# Altium schematic sheet Sheet1.SchDoc
size A4; SheetNumber: 1; SheetTotal: 1
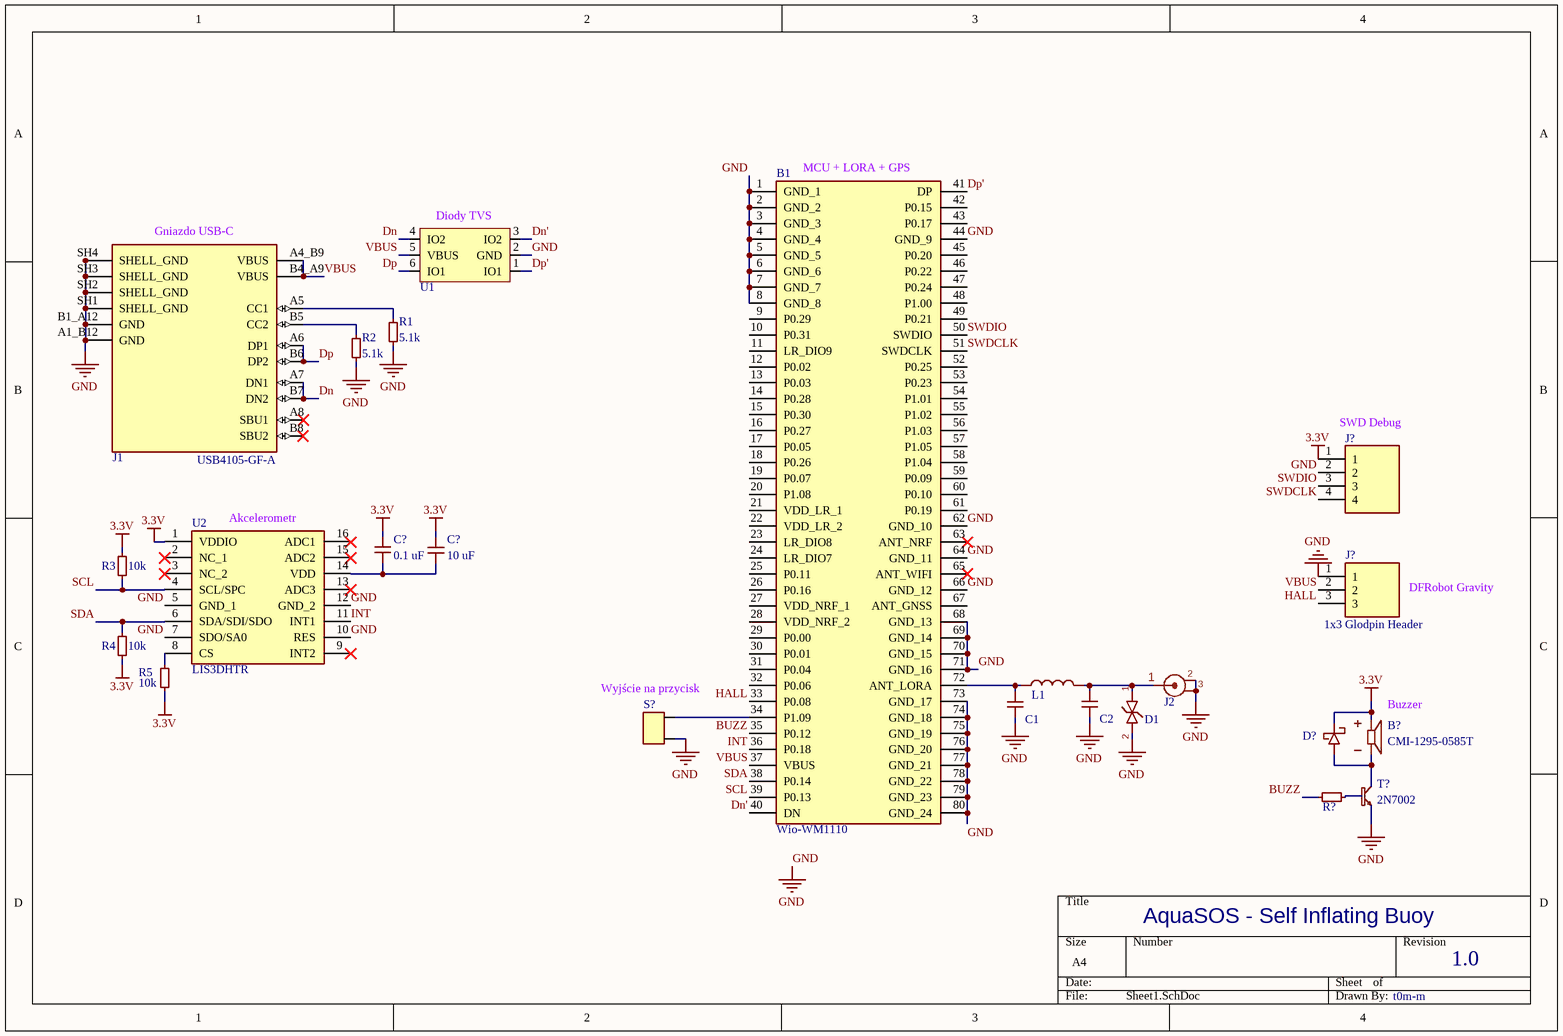
[diagram p0: Sheet1.SchDoc]

## Parts
(Parts that share a designator on the sheet are numbered #1, #2 ... from top to bottom, then left to right.)
B1  Wio-WM1110  [WioWM1110]
B?  CMI-1295-0585T  [CMI-1295-0585T]
C1  Capacitor  (value not drawn)
C2  Capacitor  (value not drawn)
C?#1  0.1 uF  [MLASU105SB7104KFNB25]
C?#2  10 uF  [KGM05CS60J106MH]
D1  PESD24VF1BBL-QYL  [PESD24VF1BBLQYL]  (value not drawn)
D?  BAT5402VH6327XTSA1  [BAT5402VH6327XTSA1]  (value not drawn)
J1  USB4105-GF-A  [GCT_USB4105-GF-A]
J2  U.FL-R-SMT-1(10)  (value not drawn)
J?#1  22-10-2041  [1x4 Goldpin Header]  (value not drawn)
J?#2  1x3 Glodpin Header  [1x3 Goldpin Header]
L1  Inductor  (value not drawn)
R1  5.1k  [RESC1005X40N]
R2  5.1k  [RESC1005X40N]
R3  10k  [RESC1005X35N]
R4  10k  [RESC1005X35N]
R5  10k  [RESC1005X35N]
R?  MR04X102 JTL  [MR04X102 JTL]  (value not drawn)
S?  PB6B2FM3M1CAL00  [PB6B2FM3M1CAL00]  (value not drawn)
T?  2N7002  [2N7002]
U1  USBLC6-2SC6  [USBLC6-2SC6]  (value not drawn)
U2  LIS3DHTR  [LIS3DHTR]

## Nets
3.3V: B?.P C?#1.1 C?#2.1 D?.2(A) J?#1.1 R3.1 R4.2 R5.2 U2.1(VDDIO)
GND: B1.1(GND_1) B1.2(GND_2) B1.3(GND_3) B1.4(GND_4) B1.5(GND_5) B1.6(GND_6) B1.7(GND_7) B1.8(GND_8) B1.44(GND_9) B1.62(GND_10) B1.64(GND_11) B1.66(GND_12) B1.68(GND_13) B1.69(GND_14) B1.70(GND_15) B1.71(GND_16) B1.73(GND_17) B1.74(GND_18) B1.75(GND_19) B1.76(GND_20) B1.77(GND_21) B1.78(GND_22) B1.79(GND_23) B1.80(GND_24) C1.2 C2.2 D1.2(A) J1.A1_B12(GND) J1.B1_A12(GND) J1.SH1(SHELL_GND) J1.SH2(SHELL_GND) J1.SH3(SHELL_GND) J1.SH4(SHELL_GND) J2.2 J2.3 J?#1.2 J?#2.1 R1.2 R2.2 S?.1 T?.2(S) U1.2(GND) U2.5(GND_1) U2.7(SDO/SA0) U2.10(RES) U2.12(GND_2)
BUZZ: B1.35(P0.12) R?.1
Dn: J1.A7(DN1) J1.B7(DN2) U1.4(IO2)
Dn': B1.40(DN) U1.3(IO2)
Dp: J1.A6(DP1) J1.B6(DP2) U1.6(IO1)
Dp': B1.41(DP) U1.1(IO1)
HALL: B1.33(P0.08) J?#2.3
INT: B1.36(P0.18) U2.11(INT1)
SCL: B1.39(P0.13) R3.2 U2.4(SCL/SPC)
SDA: B1.38(P0.14) R4.1 U2.6(SDA/SDI/SDO)
SWDCLK: B1.51(SWDCLK) J?#1.4
SWDIO: B1.50(SWDIO) J?#1.3
VBUS: B1.37(VBUS) J1.A4_B9(VBUS) J1.B4_A9(VBUS) J?#2.2 U1.5(VBUS)
NetB1_34: B1.34(P1.09) S?.2
NetB1_72: B1.72(ANT_LORA) C1.1 L1.1
NetB?_N: B?.N D?.1(K) T?.3(D)
NetC2_1: C2.1 D1.1(K) J2.1 L1.2
NetC?#1_2: C?#1.2 C?#2.2 U2.14(VDD)
NetJ1_A5: J1.A5(CC1) R1.1
NetJ1_B5: J1.B5(CC2) R2.1
NetR5_1: R5.1 U2.8(CS)
NetR?_2: R?.2 T?.1(G)

Not connected (* = marked no-connect by the designer): B1 9(P0.29) 10(P0.31) 11(LR_DIO9) 12(P0.02) 13(P0.03) 14(P0.28) 15(P0.30) 16(P0.27) 17(P0.05) 18(P0.26) 19(P0.07) 20(P1.08) 21(VDD_LR_1) 22(VDD_LR_2) 23(LR_DIO8) 24(LR_DIO7) 25(P0.11) 26(P0.16) 27(VDD_NRF_1) 28(VDD_NRF_2) 29(P0.00) 30(P0.01) 31(P0.04) 32(P0.06) 42(P0.15) 43(P0.17) 45(P0.20) 46(P0.22) 47(P0.24) 48(P1.00) 49(P0.21) 52(P0.25) 53(P0.23) 54(P1.01) 55(P1.02) 56(P1.03) 57(P1.05) 58(P1.04) 59(P0.09) 60(P0.10) 61(P0.19) 63(ANT_NRF)* 65(ANT_WIFI)* 67(ANT_GNSS); J1 A8(SBU1)* B8(SBU2)*; U2 2(NC_1)* 3(NC_2)* 9(INT2)* 13(ADC3)* 15(ADC2)* 16(ADC1)*

## Notes on the sheet
- (near B1) MCU + LORA + GPS
- (near J1) Gniazdo USB-C
- (near U1) Diody TVS
- (near J?#1) SWD Debug
- (near U2) Akcelerometr
- DFRobot Gravity
- (near S?) Wyjście na przycisk
- (near B?) Buzzer
- AquaSOS - Self Inflating Buoy
- 1.0
- t0m-m

## Library data of the parts
B1 = Wio-WM1110: LoRa Wireless Module - Powered by Semtech; Manufacturer_Name: Seeed Studio; Geometry.Height: 2.3mm; Manufacturer_Part_Number: Wio-WM1110; Mouser Part Number: *; Mouser Price/Stock: *; Arrow Part Number: *; Arrow Price/Stock: *; Datasheet Link: https://files.seeedstudio.com/products/SenseCAP/Wio-WM1110/Wio-WM1110_Module_Datasheet_V1.3.pdf; ComponentLink1Description: Shop link; ComponentLink1URL: https://botland.com.pl/lokalizatory-gps-gsm-bluetooth/23517-wio-wm1110-uklad-loragpswifibluetooth-semtech-lr1110-nordic-nrf52840-seeedstudio-114992865.html
B? = CMI-1295-0585T: Buzzer
C?#1 = MLASU105SB7104KFNB25: 0.1uF Capacitor
C?#2 = KGM05CS60J106MH: 10 uF Capacitor
D1 = PESD24VF1BBL-QYL: 24 V, Bidirectional
D? = BAT5402VH6327XTSA1: Schottky Diode
J1 = USB4105-GF-A: USB-C Connector, USB 2.0; MF: {'manufacturer': u'GCT'}; Package: None; Price: None; Value: *; MP: USB4105-GF-A; Availability: Unavailable
J2 = U.FL-R-SMT-1(10): Antenna Connector
J?#1 = 1x4 Goldpin Header: Headers & Wire Housings VERT PCB HDR 4P GOLD PLATING; Manufacturer_Name: Molex; Geometry.Height: 11.17mm; Mouser Part Number: 538-22-10-2041; Mouser Price/Stock: https://www.mouser.co.uk/ProductDetail/Molex/22-10-2041?qs=I2tGkhXPHwPlInpHG6ZNmQ%3D%3D; Manufacturer_Part_Number: 22-10-2041; Datasheet Link: https://www.molex.com/en-us/products/part-detail/22102041?display=pdf
J?#2 = 1x3 Glodpin Header: Conn Unshrouded Header HDR 3 POS 2.54mm Solder ST Thru-Hole Bag/Box; MF: TE Connectivity; MP: 644884-3; SnapEDA_Link: https://www.snapeda.com/parts/644884-3/TE+Connectivity+AMP+Connectors/view-part/?ref=snap; Package: None; Value: *; EU_RoHS_Compliance: Compliant; Check_prices: https://www.snapeda.com/parts/644884-3/TE+Connectivity+AMP+Connectors/view-part/?ref=eda
R1 R2 = RC0402JR-075K1P: 5.1k resistor; ComponentLink1Description: Mouser link; ComponentLink1URL: https://www.mouser.pl/ProductDetail/YAGEO/RC0402JR-075K1P?qs=qpJ%252B%252B%252Bdg6p1LG47uFSJoBw%3D%3D
R3-R5 = CRCW040210K0FKEDC: 10k 0402 Resistor
R? = MR04X102 JTL: 1k 0402 Resistor
S? = PB6B2FM3M1CAL00: Switch
T? = 2N7002: Transistor
U1 = USBLC6-2SC6: ESD/TVS Diodes; ComponentLink1Description: Mouser Link; ComponentLink1URL: https://www.mouser.pl/ProductDetail/STMicroelectronics/USBLC6-2SC6?qs=po45yt2pPpu%2FhNIlwQdTlg%3D%3D&utm_id=9882661914&utm_source=google&utm_medium=cpc&utm_marketing_tactic=emeacorp&gad_source=1&gad_campaignid=9882661914&gbraid=0AAAAADn_wf3e2b9L6UzwCvd5llWdJDX32&gclid=CjwKCAiAtLvMBhB_EiwA1u6_PphI6vqALNJyH9qzLX2TgkqKXihyqulPr-2MUC0dCpD_RqMgLp4OABoC-lQQAvD_BwE
U2 = LIS3DHTR: Accelerometer 3-Axis 2g/16g 1.8V LGA16 STMicroelectronics LIS3DHTR Accelerometer IC, 3-axis, I2C, SPI 1.71  3.6 V, 16-Pin LGA; Geometry.Height: 1mm; Mouser Part Number: 511-LIS3DHTR; Mouser Price/Stock: https://www.mouser.co.uk/ProductDetail/STMicroelectronics/LIS3DHTR?qs=6la6oa3D8xzhXYax3cEo4w%3D%3D; Manufacturer_Name: STMicroelectronics; Manufacturer_Part_Number: LIS3DHTR; Datasheet Link: https://www.st.com/resource/en/datasheet/lis3dh.pdf